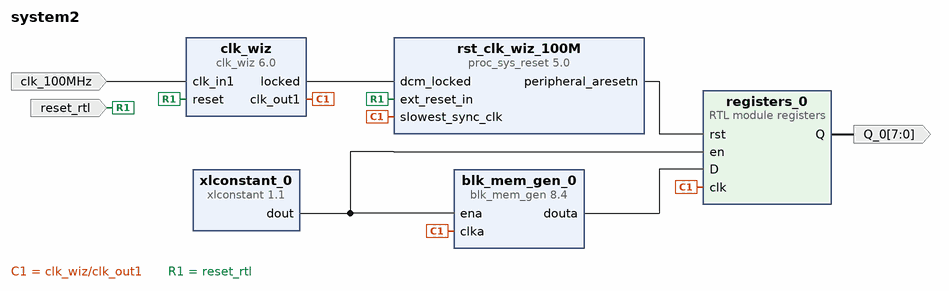
[diagram p0: block diagram of the top level]
# Vivado block design system2, xczu3eg-sbva484-1-i, Vivado 2020.1
create_bd_design system2

create_bd_port -dir I -type clk clk_100MHz
set_property -dict {CONFIG.FREQ_HZ 100000000} [get_bd_ports clk_100MHz]
create_bd_port -dir I -type rst reset_rtl
set_property -dict {CONFIG.POLARITY ACTIVE_HIGH} [get_bd_ports reset_rtl]
create_bd_port -dir O -from 7 -to 0 Q_0

create_bd_cell -type module -reference registers registers_0
create_bd_cell -type ip -vlnv xilinx.com:ip:clk_wiz:6.0 clk_wiz
create_bd_cell -type ip -vlnv xilinx.com:ip:proc_sys_reset:5.0 rst_clk_wiz_100M
create_bd_cell -type ip -vlnv xilinx.com:ip:xlconstant:1.1 xlconstant_0
create_bd_cell -type ip -vlnv xilinx.com:ip:blk_mem_gen:8.4 blk_mem_gen_0
set_property -dict [list \
  CONFIG.Coe_File ../../../../../../../FILTER_RAM.coe \
  CONFIG.Enable_32bit_Address false \
  CONFIG.Load_Init_File true \
  CONFIG.Operating_Mode_A READ_FIRST \
  CONFIG.Read_Width_A 8 \
  CONFIG.Register_PortA_Output_of_Memory_Primitives true \
  CONFIG.Use_Byte_Write_Enable false \
  CONFIG.Use_RSTA_Pin false \
  CONFIG.Write_Width_A 8 \
  CONFIG.use_bram_block Stand_Alone \
] [get_bd_cells blk_mem_gen_0]

# ---- connections ----

connect_bd_net [get_bd_pins clk_wiz/clk_out1] \
  [get_bd_pins registers_0/clk] [get_bd_pins rst_clk_wiz_100M/slowest_sync_clk] [get_bd_pins blk_mem_gen_0/clka]
connect_bd_net [get_bd_pins clk_wiz/locked] [get_bd_pins rst_clk_wiz_100M/dcm_locked]
connect_bd_net [get_bd_pins rst_clk_wiz_100M/peripheral_aresetn] [get_bd_pins registers_0/rst]
connect_bd_net [get_bd_pins xlconstant_0/dout] [get_bd_pins registers_0/en] [get_bd_pins blk_mem_gen_0/ena]
connect_bd_net [get_bd_ports clk_100MHz] [get_bd_pins clk_wiz/clk_in1]
connect_bd_net [get_bd_ports reset_rtl] [get_bd_pins clk_wiz/reset] [get_bd_pins rst_clk_wiz_100M/ext_reset_in]
connect_bd_net [get_bd_pins blk_mem_gen_0/douta] [get_bd_pins registers_0/D]
connect_bd_net [get_bd_pins registers_0/Q] [get_bd_ports Q_0]

validate_bd_design
save_bd_design
